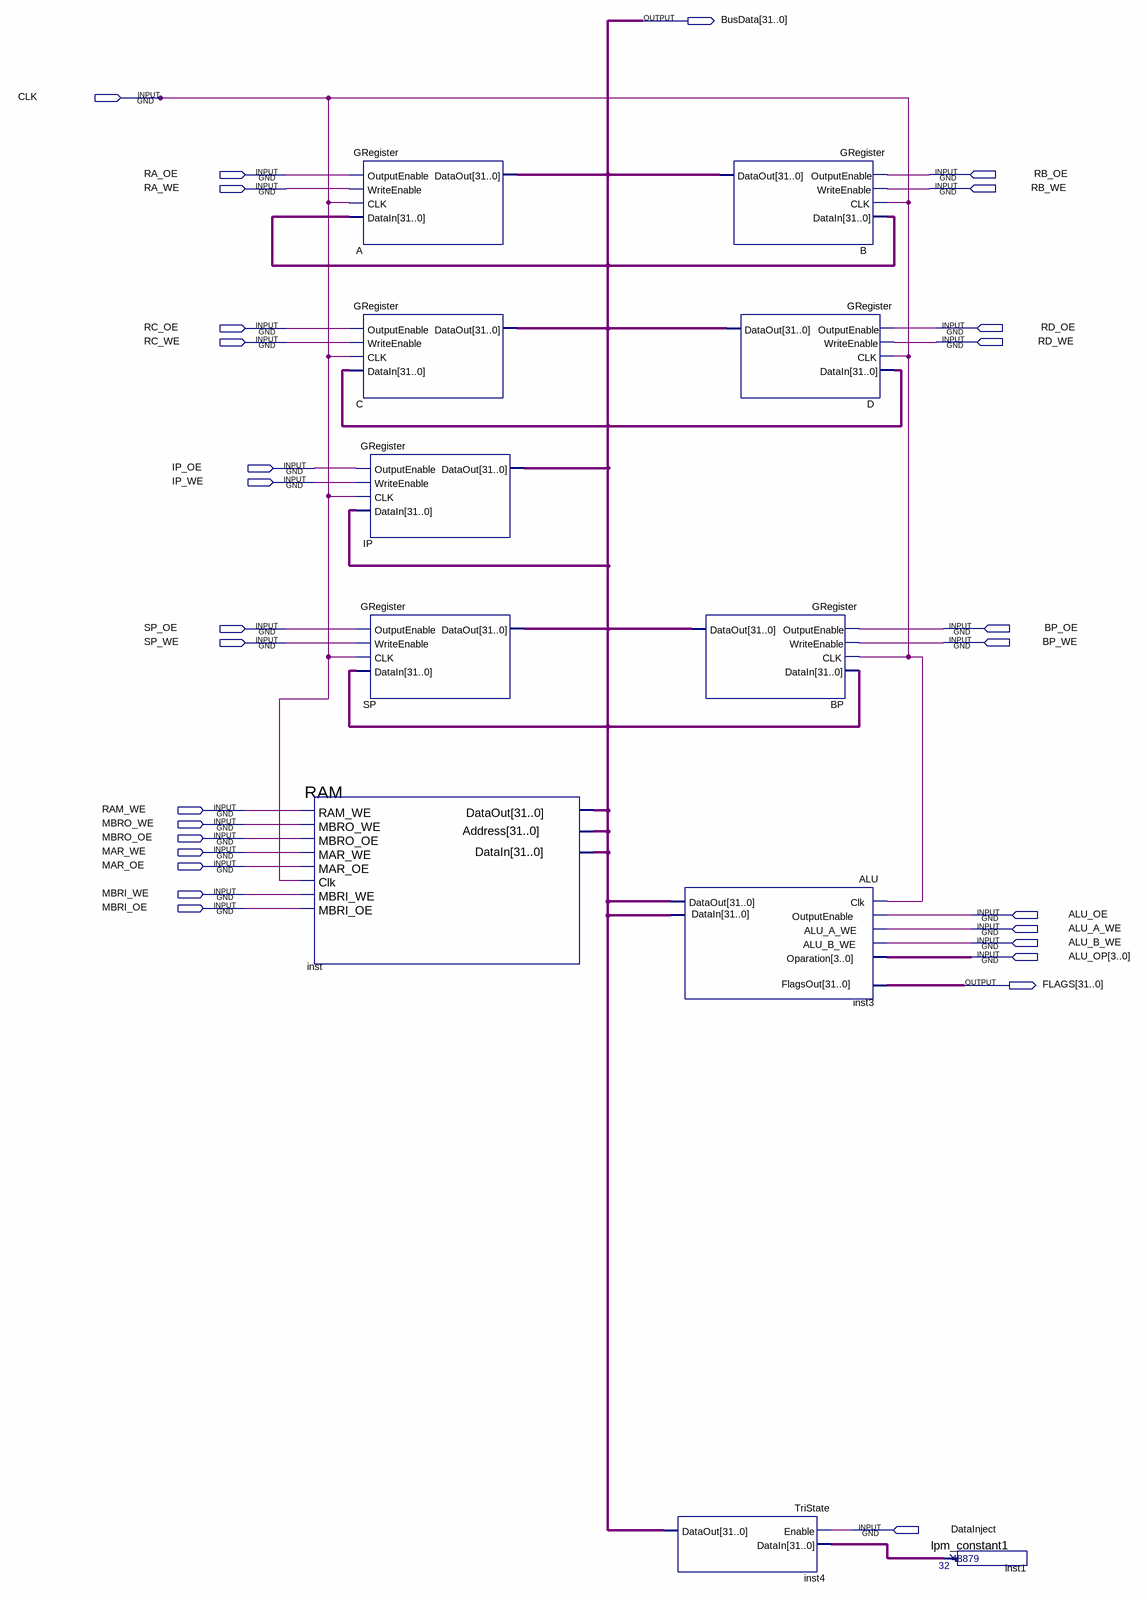
[diagram p0: schematic sheet]
// Quartus schematic Arch.bdf as structural Verilog: 11 symbols, 29 pins
module Arch (
  input  CLK,
  input  RA_OE,
  input  RB_OE,
  input  RA_WE,
  input  RB_WE,
  input  RC_OE,
  input  RD_OE,
  input  RC_WE,
  input  RD_WE,
  input  IP_OE,
  input  IP_WE,
  input  SP_OE,
  input  BP_OE,
  input  SP_WE,
  input  BP_WE,
  input  RAM_WE,
  input  MBRO_WE,
  input  MBRO_OE,
  input  MAR_WE,
  input  MAR_OE,
  input  MBRI_WE,
  input  MBRI_OE,
  input  ALU_OE,
  input  ALU_A_WE,
  input  ALU_B_WE,
  input  [3:0] ALU_OP,
  input  DataInject,
  output [31:0] BusData,
  output [31:0] FLAGS
);

  wire [31:0] inst1_result;

  RAM inst (
    .RAM_WE(RAM_WE), .MBRO_WE(MBRO_WE), .MBRO_OE(MBRO_OE), .MAR_WE(MAR_WE), .MAR_OE(MAR_OE), .Clk(CLK),
    .MBRI_WE(MBRI_WE), .MBRI_OE(MBRI_OE), .Address(BusData), .DataIn(BusData), .DataOut(BusData));
  GRegister A (.OutputEnable(RA_OE), .WriteEnable(RA_WE), .CLK(CLK), .DataIn(BusData), .DataOut(BusData));
  GRegister C (.OutputEnable(RC_OE), .WriteEnable(RC_WE), .CLK(CLK), .DataIn(BusData), .DataOut(BusData));
  GRegister IP (.OutputEnable(IP_OE), .WriteEnable(IP_WE), .CLK(CLK), .DataIn(BusData), .DataOut(BusData));
  GRegister SP (.OutputEnable(SP_OE), .WriteEnable(SP_WE), .CLK(CLK), .DataIn(BusData), .DataOut(BusData));
  GRegister BP (.OutputEnable(BP_OE), .WriteEnable(BP_WE), .CLK(CLK), .DataIn(BusData), .DataOut(BusData));
  ALU inst3 (
    .Clk(CLK), .OutputEnable(ALU_OE), .ALU_A_WE(ALU_A_WE), .ALU_B_WE(ALU_B_WE), .DataIn(BusData),
    .Oparation(ALU_OP), .DataOut(BusData), .FlagsOut(FLAGS));
  TriState inst4 (.Enable(DataInject), .DataIn(inst1_result), .DataOut(BusData));
  GRegister B (.OutputEnable(RB_OE), .WriteEnable(RB_WE), .CLK(CLK), .DataIn(BusData), .DataOut(BusData));
  GRegister D (.OutputEnable(RD_OE), .WriteEnable(RD_WE), .CLK(CLK), .DataIn(BusData), .DataOut(BusData));
  lpm_constant1 inst1 (.result(inst1_result));
endmodule
